# EAGLE design main (EAGLE 9.6.2)
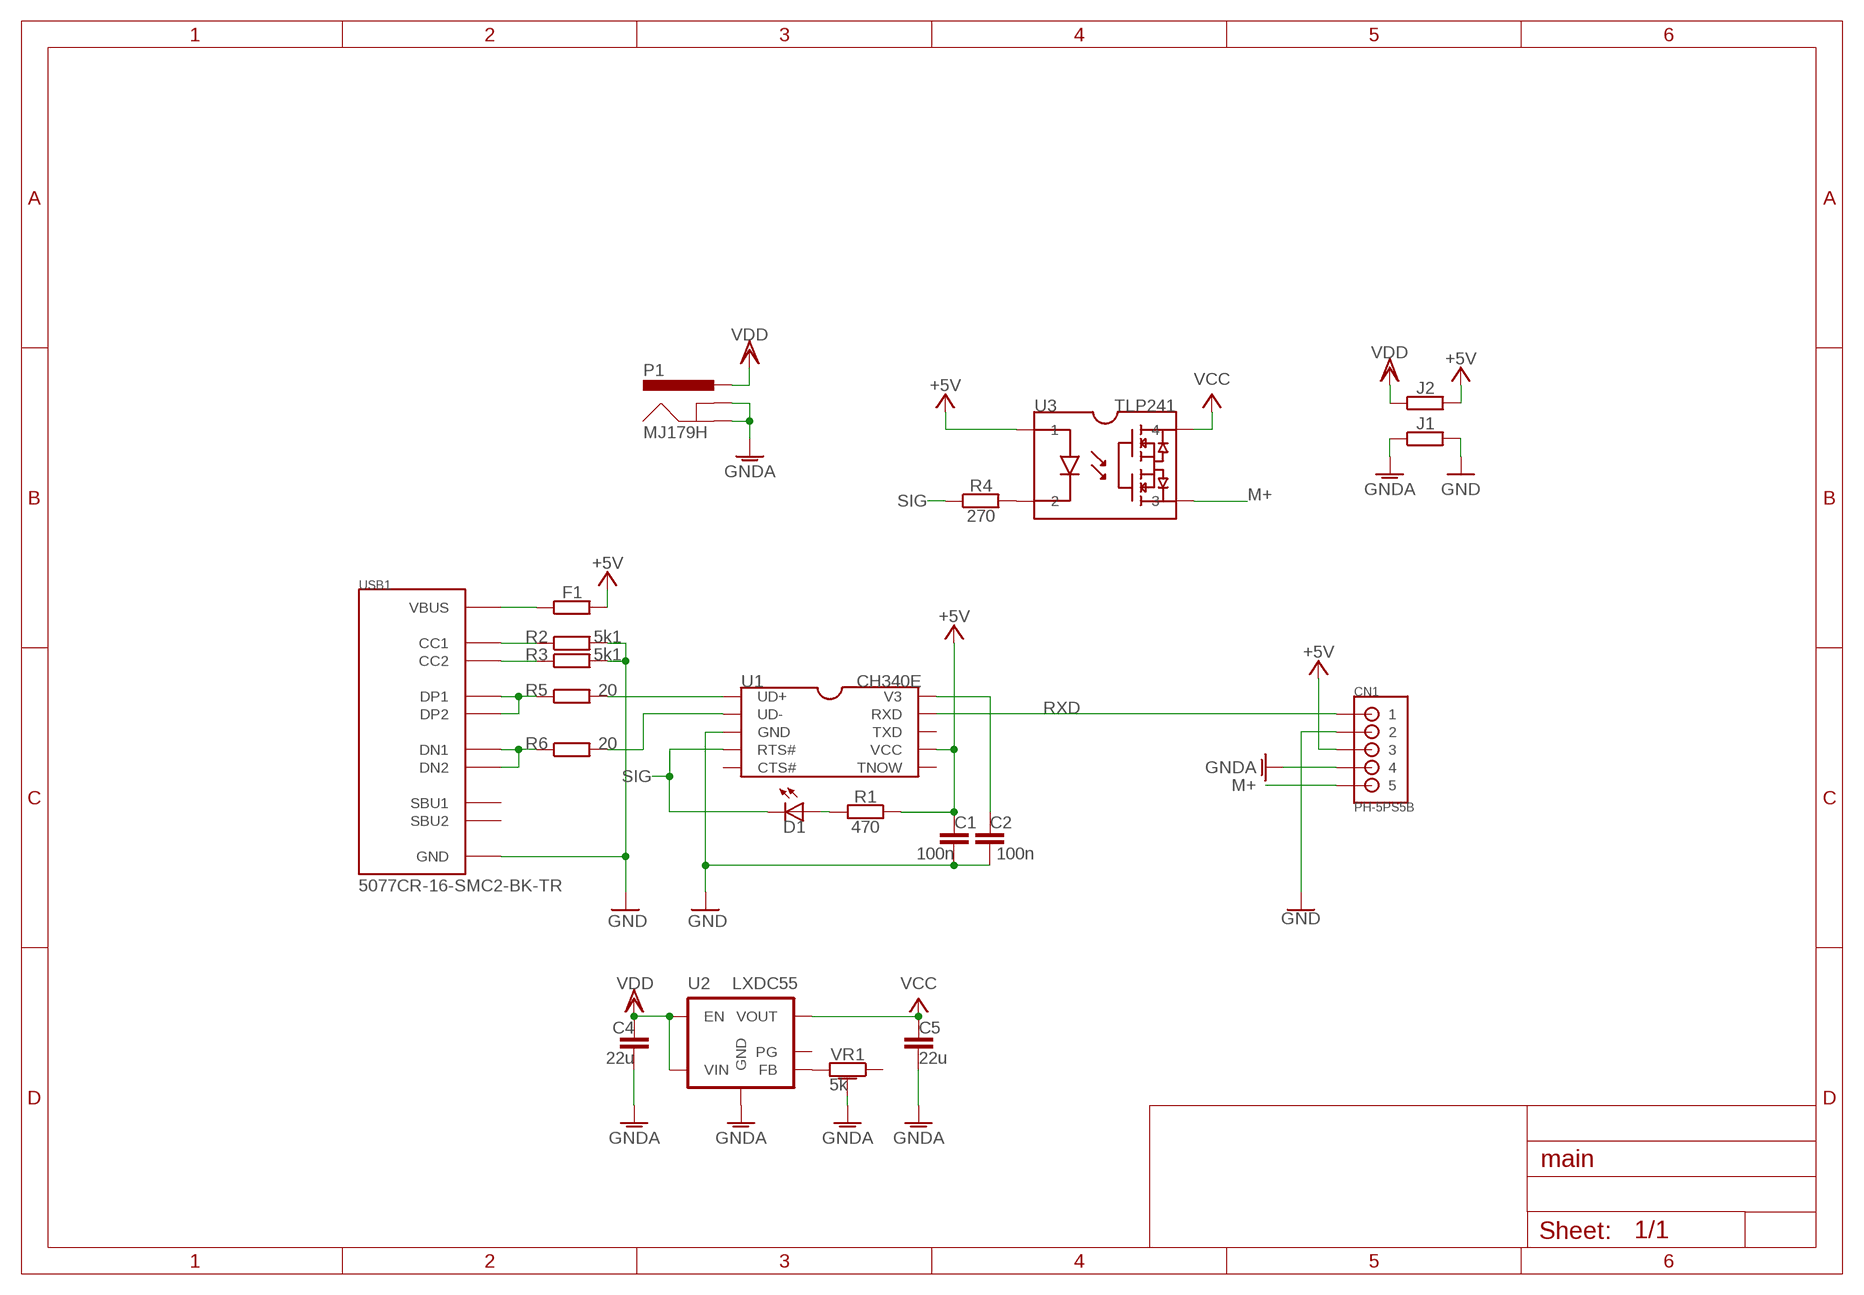
[diagram p0: schematic, sheet 1]

## Parts
C1  100n  CAPACITOR1608  [C1608]
C2  100n  CAPACITOR1608  [C1608]
C4  22u  CAPACITOR1608  [C1608]
C5  22u  CAPACITOR1608  [C1608]
CN1  PH-5PS5B  [S5B-PH-K-S]
D1  LED1608B  [LED1608B]
F1  5k1  RESISTER3225  [R3225]
J1  JUMPER2012  [J2012]
J2  JUMPER2012  [J2012]
P1  DC-JACKMJ179PH  [MJ179PH]
R1  470  RESISTER1608  [R1608]
R2  5k1  RESISTER1608  [R1608]
R3  5k1  RESISTER1608  [R1608]
R4  270  RESISTER1608  [R1608]
R5  20  RESISTER1608  [R1608]
R6  20  RESISTER1608  [R1608]
U1  CH340EMSOP  [MSOP-05-10P]
U2  LXDC55FAAA-203SMD-GND  [LXDC55FAAA-203-GND]
U3  TLP241ADIP  [DIP-4P]
USB1  USB1  USB-CSMD  [5077CR-16-SMC2-BK-TR]
VR1  5k  SEMI_VR3296W  [SEMIVR_3296W]

## Nets
+5V: C1.P$1 CN1.3 F1.P$2 J2.P$2 R1.P$1 U1.P$7(VCC) U3.P$1
GND: C1.P$2 C2.P$2 CN1.2 J1.P$2 R2.P$2 R3.P$2 U1.P$3(GND) USB1.A1_B12(GND) USB1.B1_A12(GND) USB1.P$13(GND) USB1.P$14(GND) USB1.P$15(GND) USB1.P$16(GND) USB1.P$17(GND) USB1.P$18(GND) USB1.P$19(GND) USB1.P$20(GND)
GNDA: C4.P$2 C5.P$2 CN1.4 J1.P$1 P1.BREAK1(GNDBREAK) P1.BREAK(GNDBREAK) P1.GND P1.GND1(GND) U2.P$15(GND) VR1.P$3
M+: CN1.5 U3.P$3
N$2: D1.P$1(A) R1.P$2
N$3: R6.P$1 USB1.A7(DN1) USB1.B7(DN2)
N$4: C2.P$1 U1.P$10(V3)
N$5: R2.P$1 USB1.A5(CC1)
N$6: R3.P$1 USB1.B5(CC2)
N$7: R5.P$1 USB1.A6(DP1) USB1.B6(DP2)
N$8: R6.P$2 U1.P$2(UD-)
N$9: R5.P$2 U1.P$1(UD+)
N$10: R4.P$2 U3.P$2
N$11: F1.P$1 USB1.A4_B9(VBUS) USB1.B4_A9(VBUS)
N$12: U2.P$11(FB) VR1.P$2
RXD: CN1.1 U1.P$9(RXD)
SIG: D1.P$2(K) R4.P$1 U1.P$4(RTS#)
VCC: C5.P$1 U2.P$7(VOUT) U2.P$8(VOUT) U2.P$9(VOUT) U3.P$4
VDD: C4.P$1 J2.P$1 P1.VCC1(PWR) P1.VCC(PWR) U2.P$1(EN) U2.P$3(VIN) U2.P$4(VIN) U2.P$5(VIN)
Unconnected: U1.P$5(CTS#) U1.P$6(TNOW) U1.P$8(TXD) U2.P$10(PG) USB1.A8(SBU1) USB1.B8(SBU2) VR1.P$1

## Library data of the parts
C1 C2 C4 C5 = discrete:CAPACITOR: capacitor
CN1 = con-jst-ph:PH-5P; MPN: S5B-PH-K-S
D1 = discrete:LED
F1 R1-R6 = discrete:RESISTER: resister
J1 J2 = discrete:JUMPER
P1 = akizuki:DC-JACK; PART#: MJ179H
U1 = wch:CH340E; PART#: CH340E
U2 = murata:LXDC55FAAA-203; PART#: LXDC55
U3 = toshiba:TLP241A; PART#: TLP241
USB1 = con-usb:USB-C; PART#: 5077CR-16-SMC2-BK-TR
VR1 = discrete:SEMI_VR; RESISTER: 5k

## Board
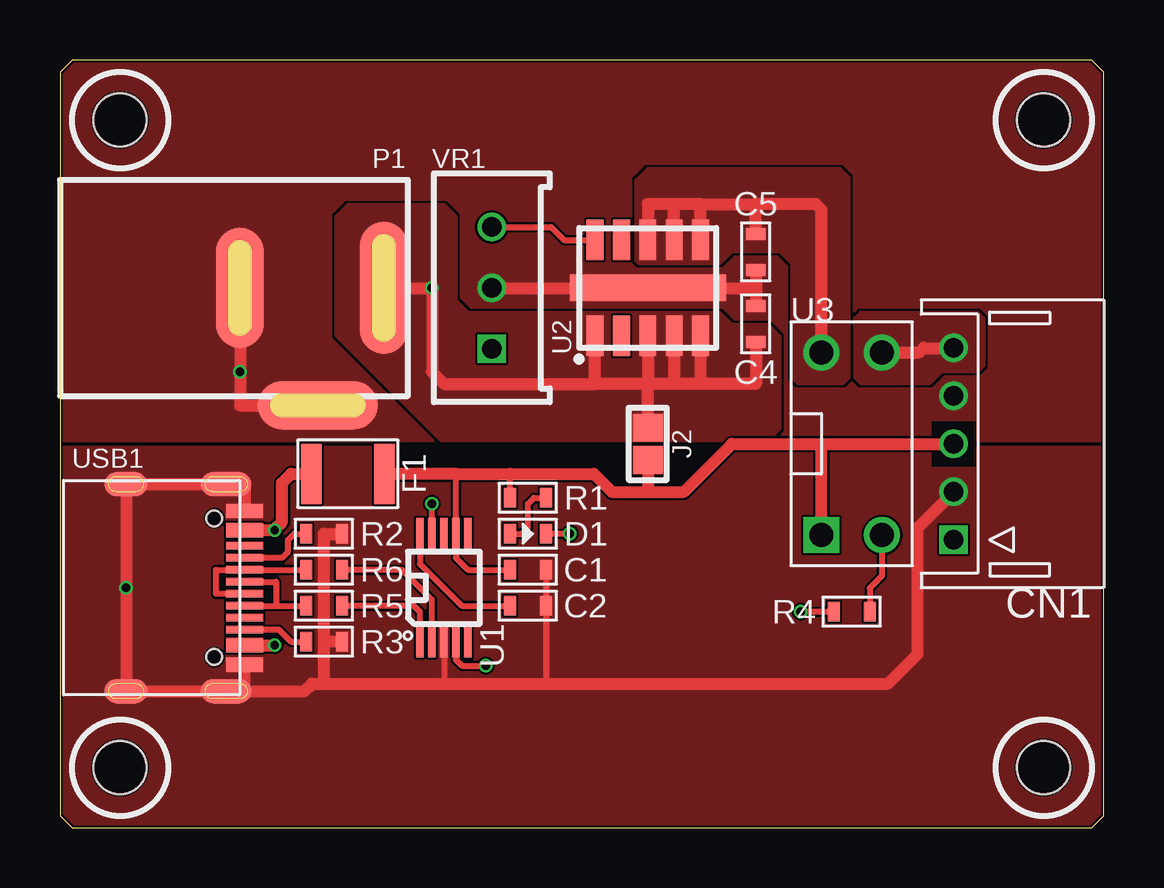
[diagram p1: board, top side]
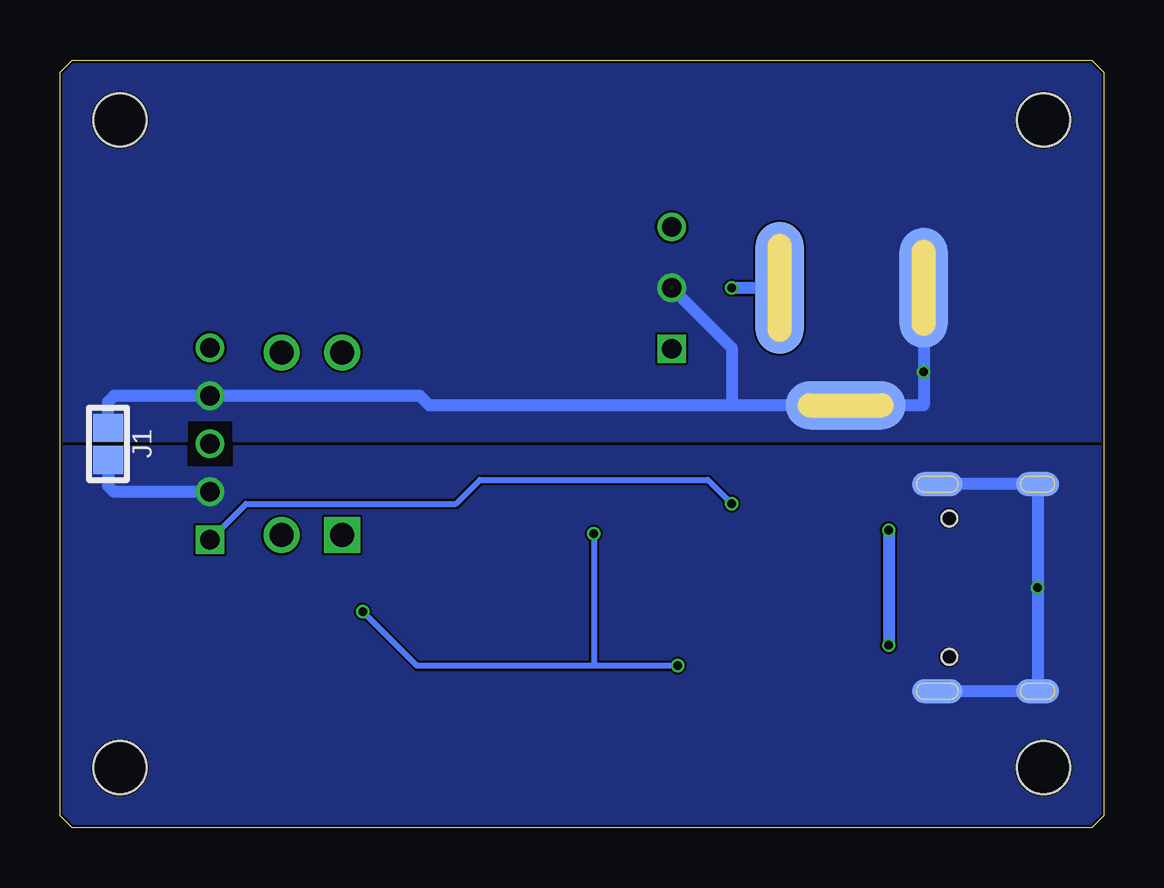
[diagram p2: board, bottom side, seen from below]

Size 43.5 x 32 mm. Coordinates in mm from the lower left corner, seen from the top.
Outline: 0.5,0 43,0 43.5,0.5 43.5,31.5 43,32 0.5,32 0,31.5 0,0.5 0.5,0
Copper layers (1*16): Top 0.035mm / dielectric 1.6mm / Bottom 0.035mm
Design rules "jlcpcb-2-layer *": minimum track width 3.5mil, minimum drill 0.2mm, track to track 3.5mil, track to pad 5mil, pad to pad 5mil, via to via 5mil, smd to smd 0mil, copper to edge 0.1mm, drill to drill 5mil, minimum pad ring 4mil, minimum via ring 4mil, stop-mask expansion 3mil, vias tented up to drill 100mil, thermal gap 10mil
Holes 2.2 mm at 41,29.5 41,2.5 2.5,2.5 2.5,29.5

### Footprints (pad centres in the part's own frame; a part is rotated, then mirrored left to right if it is on the bottom)
C1608 = smd 0.5 x 0.8: P$1 -0.75,0; P$2 0.75,0
S5B-PH-K-S = drill 0.8 square: 1 -4,0 | drill 0.8: 2 -2,0; 3 0,0; 4 2,0; 5 4,0
LED1608B = smd 0.5 x 0.8: P$1 -0.75,0; P$2 0.75,0
R3225 = smd 0.85 x 2.5: P$1 -1.525,0; P$2 1.525,0
J2012 = smd 1.15 x 1.25: P$1 -0.675,0; P$2 0.675,0
MJ179PH = smd 5 x 2: BREAK 3.25,-4.9 | smd 5 x 2 bottom: BREAK1 3.25,-4.9 | smd 2 x 5: GND 0,0 | smd 2 x 5 bottom: GND1 0,0 | smd 2 x 5.5: VCC 6,0 | smd 2 x 5.5 bottom: VCC1 6,0
R1608 = smd 0.5 x 0.8: P$1 -0.75,0; P$2 0.75,0
MSOP-05-10P = smd 1.35 x 0.3: P$1 -2.225,1; P$2 -2.225,0.5; P$3 -2.225,0; P$4 -2.225,-0.5; P$5 -2.225,-1; P$6 2.225,-1; P$7 2.225,-0.5; P$8 2.225,0; P$9 2.225,0.5; P$10 2.225,1
LXDC55FAAA-203-GND = smd 0.7 x 1.7: P$1 2.2,2; P$2 1.1,2; P$3 0,2; P$4 -1.1,2; P$5 -2.2,2; P$7 -2.2,-2; P$8 -1.1,-2; P$9 0,-2; P$10 1.1,-2; P$11 2.2,-2 | smd 6.5 x 1.1: P$15 0,0
DIP-4P = drill 1 square: P$1 -1.27,-3.81 | drill 1: P$2 1.27,-3.81; P$3 1.27,3.81; P$4 -1.27,3.81
5077CR-16-SMC2-BK-TR = smd 0.6 x 1.54: A1_B12 -3.2,4.95; A4_B9 -2.4,4.95; B1_A12 3.2,4.95; B4_A9 2.4,4.95 | smd 0.3 x 1.54: A5 -1.25,4.95; A6 -0.25,4.95; A7 0.25,4.95; A8 1.25,4.95; B5 1.75,4.95; B6 0.75,4.95; B7 -0.75,4.95; B8 -1.75,4.95 | smd 1 x 2.1: P$13 -4.32,4.18; P$14 4.32,4.18 | smd 1 x 1.8: P$15 -4.32,0; P$16 4.32,0 | smd 1 x 2.1 bottom: P$17 -4.32,4.18; P$18 4.32,4.18 | smd 1 x 1.8 bottom: P$19 4.32,0; P$20 -4.32,0 | hole 0.65: -2.89,3.68; 2.89,3.68
SEMIVR_3296W = drill 0.8 square: P$1 -2.54,0 | drill 0.8: P$2 2.54,0; P$3 0,0

### Placement (x,y rotation side)
C1  19.5,10.75 0 top
C2  19.5,9.25 0 top
C4  29,21 90 top
C5  29,24 270 top
CN1  37.25,16 90 top
D1  19.5,12.25 0 top
F1  12,14.75 0 top
J1  41.5,16 270 bottom
J2  24.5,16 270 top
P1  7.5,22.5 0 top
R1  19.5,13.75 0 top
R2  11,12.25 0 top
R3  11,7.75 0 top
R4  33,9 0 top
R5  11,9.25 0 top
R6  11,10.75 0 top
U1  16,10 90 top
U2  24.5,22.5 180 top
U3  33,16 0 top
USB1  2.75,10 270 top
VR1  18,22.5 90 top

### Tracks (layer width: path | path; a pad name or v marks a point on that pad's centre or on a via)
+5V
  Top 0.25: C1.P$1 17,10.75 16.5,11.25 U1.P$7 16.5,14.75 | R1.P$1 18.75,14.75
  Top 0.5: F1.P$2 16.5,14.75 18.75,14.75 22.25,14.75 23,14 24.5,14 | 24.5,14 26,14 28,16 31.73,16 | J2.P$2 24.5,14 | U3.P$1 31.73,16 | 31.73,16 CN1.3
GND  (via drill 0.35)
  Top 0.25: C1.P$2 C2.P$2 20.25,6 | U1.P$3 16,6
  Top 0.5: R2.P$2 11,12.25 11,7.75 | 11,6 11,7.75 | R3.P$2 11,7.75 | 11,6 10.5,6 10.18,5.68 USB1.P$18 | 11,6 16,6 20.25,6 34.5,6 35.75,7.25 35.75,12.5 CN1.2 | USB1.P$18 USB1.P$19 v2.75,10 USB1.P$15 USB1.P$17 7.7,14.32 USB1.A1_B12 | USB1.P$18 7.7,5.68 USB1.B1_A12
  Bottom 0.5: CN1.2 41.25,14 41.5,14.25 J1.P$2 | USB1.P$18 USB1.P$19 v2.75,10 USB1.P$15 USB1.P$17
  pour Bottom (rank 2, no thermals): -0.5,15.88 36.25,15.88 36.25,15 38.25,15 38.25,15.88 44,15.88 44,-0.5 -0.5,-0.5
  pour Top (rank 2, no thermals): -1,-1 -1,15.88 36.25,15.88 36.25,15 38.25,15 38.25,15.88 44.5,15.88 44.5,-1
GNDA  (via drill 0.35)
  Top 0.5: VR1.P$3 U2.P$15 29,22.5 | C5.P$2 29,22.5 | 29,22.5 C4.P$2 | P1.GND1 v7.5,19 7.5,17.6 P1.BREAK
  Bottom 0.5: 15.5,17.6 15.5,20 VR1.P$3 | 15.5,17.6 P1.BREAK 7.5,17.6 v7.5,19 P1.GND1 | J1.P$1 41.5,17.75 41.25,18 CN1.4 28.5,18 28.1,17.6 15.5,17.6
  pour Bottom (rank 2, no thermals): 38.25,17 38.25,16.12 44,16.12 44,32.5 -0.5,32.5 -0.5,16.12 36.25,16.12 36.25,17
  pour Top (rank 2, no thermals): -1,33 44.5,33 44.5,16.12 38.25,16.12 38.25,17 36.25,17 36.25,16.12 -1,16.12
M+
  Top 0.5: U3.P$3 35.81,19.81 36,20 CN1.5
  pour Top (no thermals): 36.25,18.5 33.38,18.5 33.12,18.75 33.12,21.25 33.38,21.5 38.25,21.5 38.5,21.25 38.5,19.25 38.25,19 36.75,19
N$2
  Top 0.25: D1.P$1 19.25,12.25 19.5,12.5 19.5,13.5 19.75,13.75 R1.P$2
N$3
  Top 0.25: R6.P$1 USB1.B7 6.5,10.75 6.5,9.75 USB1.A7
N$4
  Top 0.25: U1.P$10 15,11 16.75,9.25 C2.P$1
N$5
  Top 0.25: R2.P$1 9.75,12.25 9.5,12 9.5,11.5 9.25,11.25 USB1.A5
N$6
  Top 0.25: R3.P$1 9.62,7.75 9.12,8.25 USB1.B5
N$7
  Top 0.25: USB1.B6 9,9.25 | 9,9.25 R5.P$1 | USB1.A6 9,10.25 9,9.25
N$8
  Top 0.25: U1.P$2 15.5,9.5 14.25,10.75 R6.P$2
N$9
  Top 0.25: U1.P$1 15,9 14.75,9.25 R5.P$2
N$10
  Top 0.25: U3.P$2 34.27,10.5 33.75,9.98 R4.P$2
N$11  (via drill 0.35)
  Top 0.5: F1.P$1 9.62,14.75 9.25,14.38 9.25,12.75 8.95,12.45 v8.95,12.4 USB1.A4_B9 | USB1.B4_A9 v8.95,7.6
  Bottom 0.5: v8.95,12.4 v8.95,7.6
N$12
  Top 0.25: VR1.P$2 20.46,25.04 21,24.5 U2.P$11
RXD  (via drill 0.35)
  Top 0.25: U1.P$9 v15.5,13.5
  Bottom 0.25: CN1.1 35.75,13.5 27,13.5 26,14.5 16.5,14.5 v15.5,13.5
SIG  (via drill 0.35)
  Top 0.25: U1.P$4 16.5,7 16.75,6.75 v17.75,6.75 | R4.P$1 v30.88,9 | v21.25,12.25 D1.P$2
  Bottom 0.25: v17.75,6.75 21.25,6.75 | 21.25,6.75 28.62,6.75 v30.88,9 | v21.25,12.25 21.25,6.75
VCC
  Top 0.5: C5.P$1 29,26 | 26.7,26 29,26 | 26.7,26 25.6,26 | 25.6,26 24.5,26 U2.P$9 | U2.P$8 25.6,26 | U2.P$7 26.7,26 | U3.P$4 31.73,25.77 31.5,26 29,26
  pour Top (no thermals): 27.5,23.5 24.12,23.5 24,23.62 24,27 24.5,27.5 32.5,27.5 32.88,27.12 32.88,18.75 32.62,18.5 30.75,18.5 30.5,18.75 30.5,23.5 30,24 28,24
VDD  (via drill 0.35)
  Top 0.5: U2.P$5 26.7,18.5 | 22.3,18.5 U2.P$1 | 26.7,18.5 25.6,18.5 | 25.6,18.5 24.5,18.5 | 24.5,18.5 22.3,18.5 | U2.P$3 24.5,18.5 | U2.P$4 25.6,18.5 | C4.P$1 29,18.5 26.7,18.5 | 22.3,18.5 16,18.5 15.5,19 v15.5,22.5 P1.VCC1 | J2.P$1 24.5,18.5
  Bottom 0.5: P1.VCC1 v15.5,22.5
  pour Top (no thermals): 11.5,20.5 11.5,25.5 12,26 16,26 16.5,25.5 16.5,22 17,21.5 27.5,21.5 28,21 29.5,21 30,20.5 30,16.62 29.5,16.12 15.88,16.12

### Text on the board
tNames: P1 | VR1 | USB1